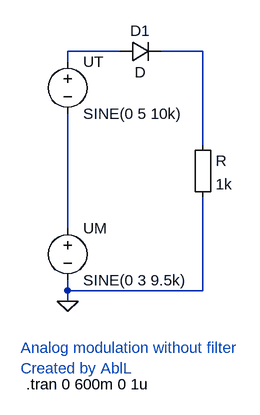
[diagram p0: schematic Analoge-Modulation_ohne_Filter.asc]
Analoge-Modulation_ohne_Filter.asc, the LTspice schematic file:
Version 4
SHEET 1 880 680
WIRE 128 -32 48 -32
WIRE 256 -32 192 -32
WIRE 48 -16 48 -32
WIRE 256 112 256 -32
WIRE 48 240 48 64
WIRE 48 336 48 320
WIRE 256 336 256 192
WIRE 256 336 48 336
WIRE 48 352 48 336
FLAG 48 352 0
SYMBOL Misc\\EuropeanResistor 240 96 R0
SYMATTR InstName R
SYMATTR Value 1k
SYMBOL voltage 48 -32 R0
WINDOW 123 0 0 Left 0
WINDOW 39 0 0 Left 0
SYMATTR InstName UT
SYMATTR Value SINE(0 5 10k)
SYMBOL voltage 48 224 R0
WINDOW 123 0 0 Left 0
WINDOW 39 0 0 Left 0
SYMATTR InstName UM
SYMATTR Value SINE(0 3 9.5k)
SYMBOL diode 128 -16 R270
WINDOW 0 32 32 VTop 2
WINDOW 3 0 32 VBottom 2
SYMATTR InstName D1
TEXT -16 480 Left 2 !.tran 0 600m 0 1u
TEXT -24 424 Left 2 ;Analog modulation without filter\nCreated by AblL

The netlist it stands for:
* Analoge-Modulation_ohne_Filter.asc
R N002 0 1k
V§UT N001 N003 SINE(0 5 10k)
V§UM N003 0 SINE(0 3 9.5k)
D1 N001 N002 D
.model D D
.lib standard.dio
.tran 0 600m 0 1u
* Analog modulation without filter
* Created by AblL
.backanno
.end